# EAGLE design SND_SMD_Replacement (EAGLE 9.6.2)
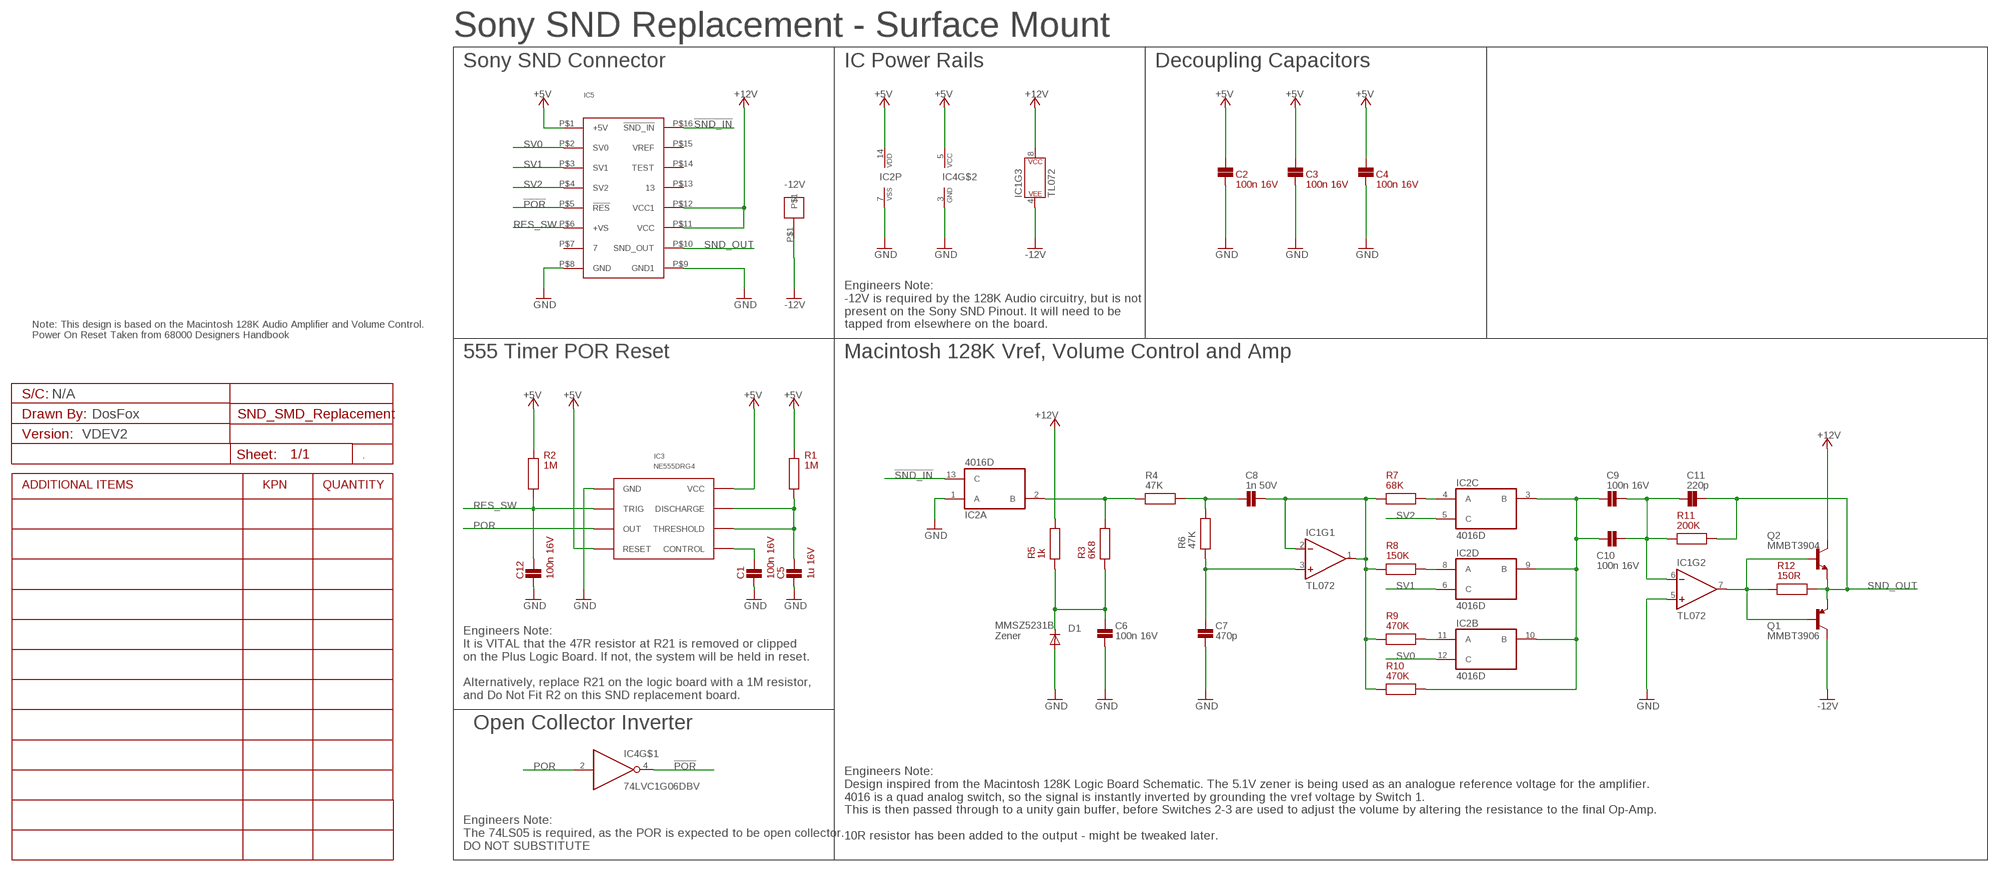
[diagram p0: schematic, sheet 1]

## Parts
-12V  PADS_1W_SMD  [SINGLE_CONN_SMD]
A1  VDEV2  PROJECT_DETAILS_CUSTOM  [PCB_CUSTOM_DETAILS]
C1  100n 16V  100N_CAP_0603  [C0603]
C2  100n 16V  100N_CAP_0603  [C0603]
C3  100n 16V  100N_CAP_0603  [C0603]
C4  100n 16V  100N_CAP_0603  [C0603]
C5  1u 16V  1U_CAP_0603  [C0603]
C6  100n 16V  100N_CAP_0603  [C0603]
C7  470p  100P_CAP_0603  [C0603]
C8  1n 50V  10N_CAP_0603  [C0603]
C9  100n 16V  100N_CAP_0603  [C0603]
C10  100n 16V  100N_CAP_0603  [C0603]
C11  220p  100P_CAP_0603  [C0603]
C12  100n 16V  100N_CAP_0603  [C0603]
D1  5.1V  DIODESOD-123  [SOD-123]
IC1  TL072  OPAMP-DUALU  [SO08]
IC2  4016D  [SO14]
IC3  NE555DRG4  555_SOIC8  [SOIC8]
IC4  74LVC1G06DBV  [SOT23-5]
IC5  SND  [DIP16]
Q1  MMBT3906  TRANS_PNP-PMBT3906|MMBT3906L  [SOT23-3]
Q2  MMBT3904  TRANS_NPN-MMBT2222AL  [SOT23-3]
R1  1M  GENERIC_RESISTOR_0603  [R0603]
R2  1M  GENERIC_RESISTOR_0603  [R0603]
R3  6K8  GENERIC_RESISTOR_0603  [R0603]
R4  47K  47K_RESISTOR  [R0603]
R5  1k  1K_RESISTOR_0603  [R0603]
R6  47K  47K_RESISTOR  [R0603]
R7  68K  GENERIC_RESISTOR_0603  [R0603]
R8  150K  GENERIC_RESISTOR_0603  [R0603]
R9  470K  GENERIC_RESISTOR_0603  [R0603]
R10  470K  GENERIC_RESISTOR_0603  [R0603]
R11  200K  GENERIC_RESISTOR_0603  [R0603]
R12  150R  150R_RESISTOR_0603  [R0603]

## Nets
!POR: IC4.4(O) IC5.P$5(!RES)
!SND_IN: IC2.13(A:C) IC5.P$16(!SND_IN)
+5V: C2.2 C3.2 C4.2 IC2.14(P:VDD) IC3.P$4(RESET) IC3.P$8(VCC) IC4.5(VCC) IC5.P$1(+5V) R1.2 R2.2 ; supply symbol labelled VCC
+12V: IC1.8(P$V+) IC5.P$11(VCC) IC5.P$12(VCC1) Q2.3(C) R5.2 ; supply symbol labelled VCC
-12V: -12V.P$1 IC1.4(P$V-) Q1.3(C) ; supply symbol labelled GND
GND: C1.1 C2.1 C3.1 C4.1 C5.1 C6.1 C7.1 C12.1 D1.A IC1.5(+IN) IC2.1(A:A) IC2.7(P:VSS) IC3.P$1(GND) IC4.3(GND) IC5.P$8(GND) IC5.P$9(GND1)
N$1: IC2.2(A:B) R3.2 R4.1
N$3: C9.1 C10.1 IC2.3(C:B) IC2.9(D:B) IC2.10(B:B) R10.2
N$4: C8.1 R4.2 R6.2
N$5: C6.2 D1.C R3.1 R5.1
N$6: C7.2 IC1.3(+IN) R6.1
N$7: IC2.4(C:A) R7.2
N$8: IC2.8(D:A) R8.2
N$9: IC2.11(B:A) R9.2
N$10: C9.2 C10.2 C11.1 IC1.6(-IN) R11.1
N$11: C5.2 IC3.P$6(THRESHOLD) IC3.P$7(DISCHARGE) R1.1
N$12: C8.2 IC1.1(OUT) IC1.2(-IN) R7.1 R8.1 R9.1 R10.1
N$15: IC1.7(OUT) Q1.1(B) Q2.1(B) R12.1
N$17: C1.2 IC3.P$5(CONTROL)
POR: IC3.P$3(OUT) IC4.2(I)
RES_SW: C12.2 IC3.P$2(TRIG) IC5.P$6(+VS) R2.1
SND_OUT: C11.2 IC5.P$10(SND_OUT) Q1.2(E) Q2.2(E) R11.2 R12.2
SV0: IC2.12(B:C) IC5.P$2(SV0)
SV1: IC2.6(D:C) IC5.P$3(SV1)
SV2: IC2.5(C:C) IC5.P$4(SV2)
Unconnected: IC5.P$7 IC5.P$13 IC5.P$14(TEST) IC5.P$15(VREF)

## Notes on the sheet
- Sony SND Replacement - Surface Mount
- Sony SND Connector | IC Power Rails | Decoupling Capacitors
- Engineers Note:
  -12V is required by the 128K Audio circuitry, but is not 
  present on the Sony SND Pinout. It will need to be 
  tapped from elsewhere on the board.
- Note: This design is based on the Macintosh 128K Audio Amplifier and Volume Control. 
  Power On Reset Taken from 68000 Designers Handbook
- 555 Timer POR Reset | Macintosh 128K Vref, Volume Control and Amp
- N/A
- DosFox
- MMSZ5231B
  Zener
- Engineers Note:
  It is VITAL that the 47R resistor at R21 is removed or clipped
  on the Plus Logic Board. If not, the system will be held in reset. 
  
  Alternatively, replace R21 on the logic board with a 1M resistor,
  and Do Not Fit R2 on this SND replacement board.
- Open Collector Inverter
- Engineers Note:
  Design inspired from the Macintosh 128K Logic Board Schematic. The 5.1V zener is being used as an analogue reference voltage for the amplifier. 
  4016 is a quad analog switch, so the signal is instantly inverted by grounding the vref voltage by Switch 1. 
  This is then passed through to a unity gain buffer, before Switches 2-3 are used to adjust the volume by altering the resistance to the final Op-Amp. 
  
  10R resistor has been added to the output - might be tweaked later.
- Engineers Note:
  The 74LS05 is required, as the POR is expected to be open collector.
  DO NOT SUBSTITUTE

## Library data of the parts
-12V = Connectors:PADS_1W_SMD
A1 = Schematic Symbols:PROJECT_DETAILS; VALUE: VDEV1
C1-C4 C6 C9 C10 C12 = Capacitors SMD:100N_CAP; COMPONENT: Capacitor; COST: =(INDIRECT(ADDRESS(ROW(),1)))*(INDIRECT(ADDRESS(ROW(),13))); EA: =VLOOKUP(INDIRECT(ADDRESS(ROW(),7)),[ProductCosts.xlsx]StockCosts!$A:$B,2,FALSE); KPN: 3106-100N; PACKAGE: 0603; PROCESS: SMD
C5 = Capacitors SMD:1U_CAP; COMPONENT: Capacitor; COST: =(INDIRECT(ADDRESS(ROW(),1)))*(INDIRECT(ADDRESS(ROW(),13))); EA: =VLOOKUP(INDIRECT(ADDRESS(ROW(),7)),[ProductCosts.xlsx]StockCosts!$A:$B,2,FALSE); KPN: 3106-1U; PACKAGE: 0603; PROCESS: SMD
C7 C11 = Capacitors SMD:100P_CAP; COMPONENT: Capacitor; COST: =(INDIRECT(ADDRESS(ROW(),1)))*(INDIRECT(ADDRESS(ROW(),13))); EA: =VLOOKUP(INDIRECT(ADDRESS(ROW(),7)),[ProductCosts.xlsx]StockCosts!$A:$B,2,FALSE); KPN: xxxx; PACKAGE: 0603; PROCESS: SMD; VALUE: 100p
C8 = Capacitors SMD:10N_CAP; COMPONENT: Capacitor; COST: =(INDIRECT(ADDRESS(ROW(),1)))*(INDIRECT(ADDRESS(ROW(),13))); EA: =VLOOKUP(INDIRECT(ADDRESS(ROW(),7)),[ProductCosts.xlsx]StockCosts!$A:$B,2,FALSE); KPN: 3106-10N; PACKAGE: 0603; PROCESS: SMD; VALUE: 10n 50V
D1 = adafruit:DIODE: Diode SMADIODE - SMA Surface Mount Package 20V 1A Schottky Diode Digikey: 641-1014-6-ND DO-1N4148 - Through Hole Small Current Diode SOD-123 20V 1 A (.5mV Vf) Schottky Diode - Digikey: MBRX120TPMSCT-ND SOD-323 10V 570mA (.38mV Vf, 3ns) Schottky Diode - Digikey: ZLLS410CT-ND SOD-523 30V 30mA Schottky Diode (RB751S-40TE61) - Digikey: RB751S-40TE61CT-ND SOT23-R/W - SOT23 Package (R = Solder Paste/Reflow Ovens, W = Hand-Soldering) BAT54Film 40V 300mA - Digikey: 497-7162-1-ND
IC1 = SparkFun-IC-Amplifiers:OPAMP-DUAL: Generic op-amp footprint This component is for the standard 358 pinning of a dual op-amp From the LM358 datasheet: Pin 1: Output A Pin 2: Inverting Input A Pin 3: Non-Inverting Input A Pin 4: Gnd Pin 5: Non-Inverting Input B Pin 6: Inverting Input B Pin 7: Output B Pin 8: V+; PROD_ID: NA-XXXXX; VALUE: OP-AMP
IC2 = 40xx:4016: Quad bilateral ANALOG SWITCH
IC3 = ICs:555; COMPONENT: 555 Timer; COST: =(INDIRECT(ADDRESS(ROW(),1)))*(INDIRECT(ADDRESS(ROW(),13))); EA: =VLOOKUP(INDIRECT(ADDRESS(ROW(),7)),[ProductCosts.xlsx]StockCosts!$A:$B,2,FALSE); KPN: xxxxx; MANUFACTURE: Texas Instruments; PACKAGE: SOIC8; PROCESS: SMD
IC4 = 74xx-little-us:74*1G06: Single Inverter Buffer/Driver With Open-Drain Output
IC5 = ICs:SND; PACKAGE: DIP16; PROCESS: TH
Q1 = SparkFun-DiscreteSemi:TRANS_PNP: PNP transistor Current controlled devices typically used to amplify current or used as a switch. SparkFun Products: SparkFun Serial Enabled 16x2 LCD - Red on Black <https://www.sparkfun.com/products/9068> SparkFun Logomatic <https://www.sparkfun.com/products/12772>; PROD_ID: TRANS-08052; VALUE: 200mA/40V
Q2 = SparkFun-DiscreteSemi:TRANS_NPN: NPN transistor Current controlled devices typically used to amplify current or used as a switch. BC547 - COM-08928 <http://www.sparkfun.com/products/8928> (TO-92 45V 100mA) (1.Collector 2.Base 3.Emitter) 2N3904 - COM-00521 <http://www.sparkfun.com/products/521> (TO-92 40V 200mA) (1.Emitter 2.Base 3.Collector) P2N2222A - COM-12852 <http://www.sparkfun.com/products/12852> (TO-92 40V 600mA) (1.Collector 2.Base 3.Emitter); PROD_ID: TRANS-08049; VALUE: 600mA/40V
R1-R3 R7-R11 = Resistors SMD:GENERIC_RESISTOR; COMPONENT: Resistor; COST: =(INDIRECT(ADDRESS(ROW(),1)))*(INDIRECT(ADDRESS(ROW(),13))); EA: =VLOOKUP(INDIRECT(ADDRESS(ROW(),7)),[ProductCosts.xlsx]StockCosts!$A:$B,2,FALSE); PACKAGE: 0603; PROCESS: SMD
R4 R6 = Resistors SMD:47K_RESISTOR; COMPONENT: Resistor; COST: =(INDIRECT(ADDRESS(ROW(),1)))*(INDIRECT(ADDRESS(ROW(),13))); EA: =VLOOKUP(INDIRECT(ADDRESS(ROW(),7)),[ProductCosts.xlsx]StockCosts!$A:$B,2,FALSE); KPN: 3014-47K; PACKAGE: 0603; PROCESS: SMD
R5 = Resistors SMD:1K_RESISTOR; COMPONENT: Resistor; COST: =(INDIRECT(ADDRESS(ROW(),1)))*(INDIRECT(ADDRESS(ROW(),13))); EA: =VLOOKUP(INDIRECT(ADDRESS(ROW(),7)),[ProductCosts.xlsx]StockCosts!$A:$B,2,FALSE); KPN: 3014-1K; PACKAGE: 0603; PROCESS: SMD
R12 = Resistors SMD:150R_RESISTOR; COMPONENT: Resistor; COST: =(INDIRECT(ADDRESS(ROW(),1)))*(INDIRECT(ADDRESS(ROW(),13))); EA: =VLOOKUP(INDIRECT(ADDRESS(ROW(),7)),[ProductCosts.xlsx]StockCosts!$A:$B,2,FALSE); KPN: 3013-150R; PACKAGE: 0603; PROCESS: SMD

## Board
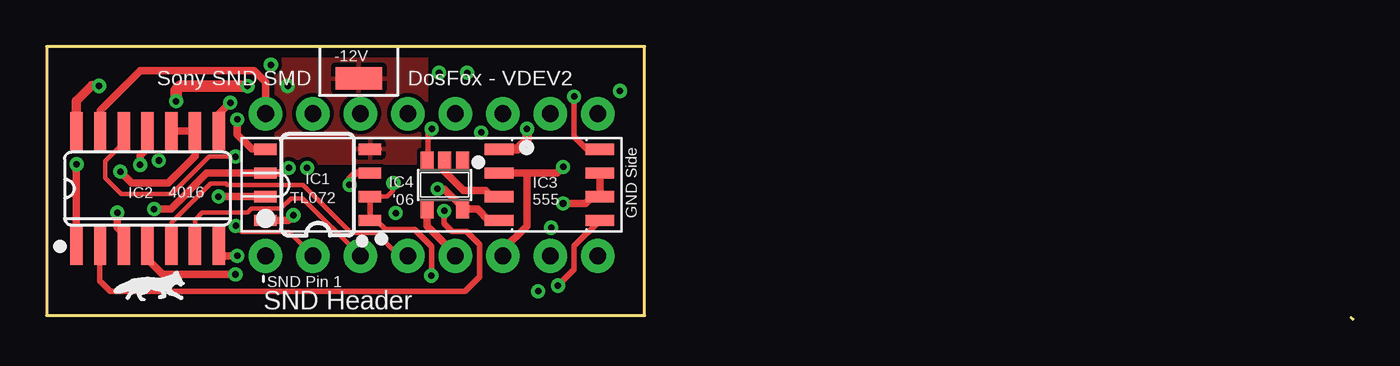
[diagram p1: board, top side]
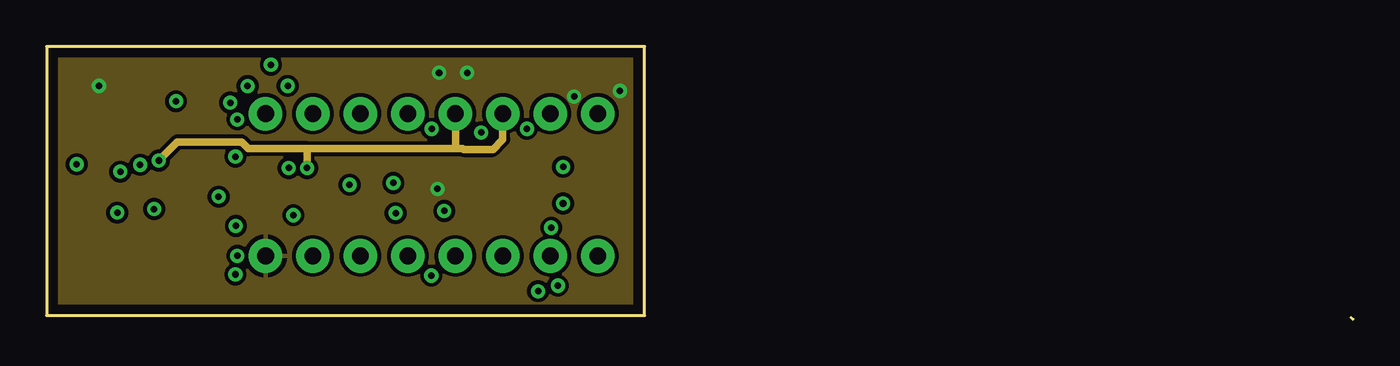
[diagram p2: board, inner layer Route2]
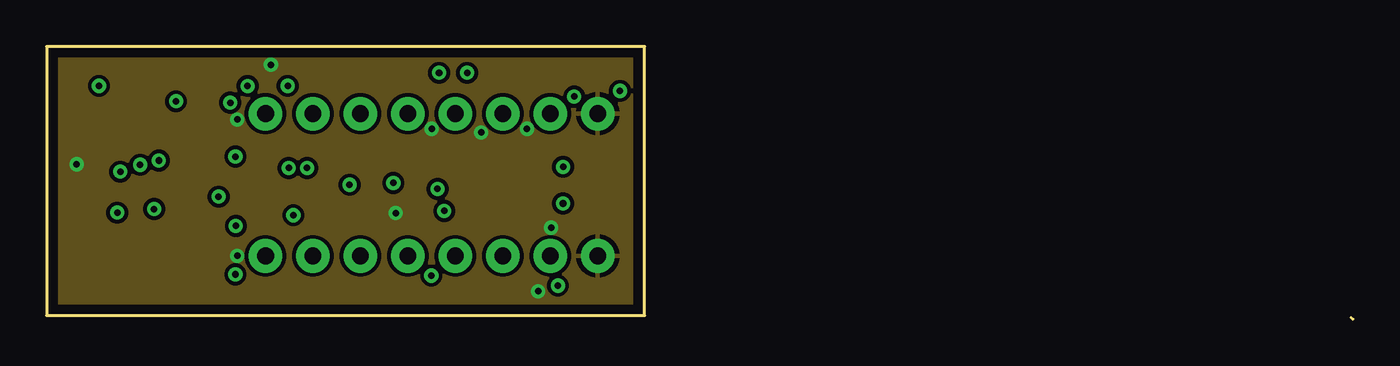
[diagram p3: board, inner layer Route15]
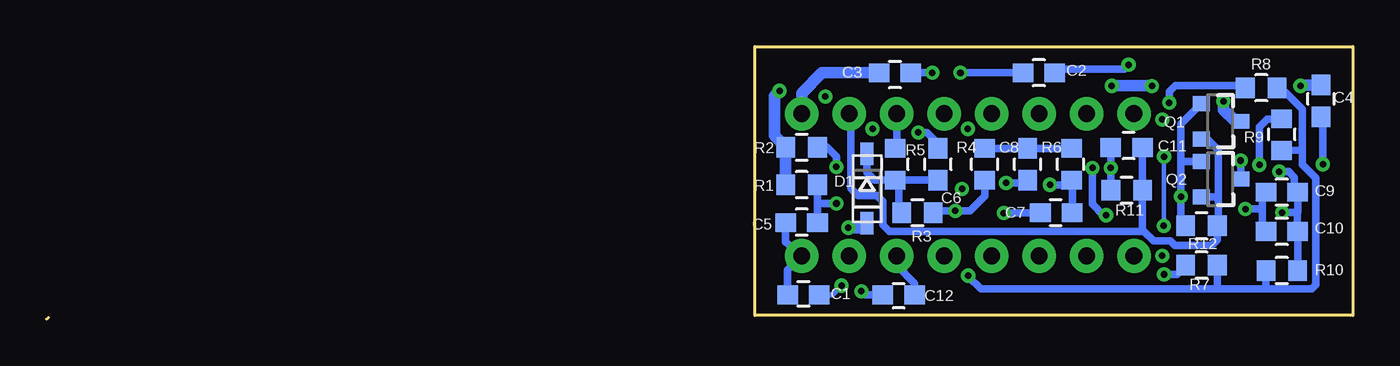
[diagram p4: board, bottom side, seen from below]

Size 69.9 x 14.6 mm. Coordinates in mm from the lower left corner, seen from the top.
Outline: 69.8,0.1 69.9,0
Outline: 0,0.2 32,0.2 32,14.6 0,14.6 0,0.2
Copper layers (1+2*15+16): Top 0.035mm / dielectric 1.5mm / Route2 0.035mm / dielectric 0.15mm / Route15 0.035mm / dielectric 0.2mm / Bottom 0.035mm
Design rules "default *": minimum track width 0.2mm, minimum drill 0.25mm, track to track 8mil, track to pad 8mil, pad to pad 8mil, via to via 8mil, smd to smd 8mil, copper to edge 20mil, drill to drill 8mil, minimum pad ring 1mil, minimum via ring 8mil, stop-mask expansion 4mil, vias tented up to drill 1mm, thermal gap 10mil

### Footprints (pad centres in the part's own frame; a part is rotated, then mirrored left to right if it is on the bottom)
SINGLE_CONN_SMD = smd 2.5 x 1.2: P$1 0,0
C0603 = smd 1.1 x 1: 1 -0.85,0; 2 0.85,0
SOD-123 = smd 1.2 x 0.7: A 1.85,0; C -1.85,0
SO08 = smd 0.6 x 1.2: 1 -1.905,-2.8; 2 -0.635,-2.8; 3 0.635,-2.8; 4 1.905,-2.8; 5 1.905,2.8; 6 0.635,2.8; 7 -0.635,2.8; 8 -1.905,2.8
SO14 = smd 0.66 x 2.032: 1 -3.81,-3.073; 2 -2.54,-3.073; 3 -1.27,-3.073; 4 0,-3.073; 5 1.27,-3.073; 6 2.54,-3.073; 7 3.81,-3.073; 8 3.81,3.073; 9 2.54,3.073; 10 1.27,3.073; 11 0,3.073; 12 -1.27,3.073; 13 -2.54,3.073; 14 -3.81,3.073
SOIC8 = smd 1.55 x 0.6: P$1 -2.7,1.905; P$2 -2.7,0.635; P$3 -2.7,-0.635; P$4 -2.7,-1.905; P$5 2.7,-1.905; P$6 2.7,-0.635; P$7 2.7,0.635; P$8 2.7,1.905
SOT23-5 = smd 0.69 x 0.99: 1 -0.95,-1.29; 2 0,-1.29; 3 0.95,-1.29; 4 0.95,1.3; 5 -0.95,1.3
DIP16 = drill 0.9 pad 1.8: P$1 -8.89,-3.81; P$2 -6.35,-3.81; P$3 -3.81,-3.81; P$4 -1.27,-3.81; P$5 1.27,-3.81; P$6 3.81,-3.81; P$7 6.35,-3.81; P$8 8.89,-3.81; P$9 8.89,3.81; P$10 6.35,3.81; P$11 3.81,3.81; P$12 1.27,3.81; P$13 -1.27,3.81; P$14 -3.81,3.81; P$15 -6.35,3.81; P$16 -8.89,3.81
SOT23-3 = smd 0.8 x 0.9: 1 -0.95,-1; 2 0.95,-1; 3 0,1.1
R0603 = smd 1 x 1.1: 1 -0.85,0; 2 0.85,0

### Placement (x,y rotation side)
-12V  16.7,12.9 0 top
A1  -120.65,1.47 0 top  (outside the outline)
C1  29.4,1.3 0 bottom
C2  16.8,13.2 180 bottom
C3  24.5,13.2 0 bottom
C4  1.7,11.7 90 bottom
C5  29.5,5.17 0 bottom
C6  22.2,8.3 270 bottom
C7  15.87,5.7 0 bottom
C8  17.4,8.3 270 bottom
C9  3.8,6.8 180 bottom
C10  3.8,4.7 180 bottom
C11  12.1,9.2 0 bottom
C12  24.3,1.3 0 bottom
D1  26,7 270 bottom
IC1  14.5,7.2 90 top
IC2  5.4,7 0 top
IC3  26.9,7.2 0 top
IC4  21.3,7.2 180 top
IC5  20.6,7.2 0 top
Q1  7.1,10.6 270 bottom
Q2  7.1,7.5 270 bottom
R1  29.5,7.2 180 bottom
R2  29.5,9.22 180 bottom
R3  23.3,5.7 0 bottom
R4  19.7,8.3 90 bottom
R5  24.5,8.3 90 bottom
R6  15.05,8.3 90 bottom
R7  8.1,2.9 180 bottom
R8  4.9,12.4 180 bottom
R9  3.81,9.88 90 bottom
R10  3.8,2.6 0 bottom
R11  12.1,6.9 0 bottom
R12  8.1,5 0 bottom

### Tracks (layer width: path | path; a pad name or v marks a point on that pad's centre or on a via)
!POR
  Top 0.406: IC5.P$5 21.87,3.48 20.35,5 IC4.4
!SND_IN
  Top 0.406: IC5.P$16 11.71,12.71 11.12,13.3 5,13.3 2.86,11.16 IC2.13
+5V  (via drill 0.35)
  Top 0.305: v28.23,11.93 28.23,9.77 28.9,9.1 IC3.P$8
  Top 0.406: IC3.P$4 23.66,5.29 23.05,5.9 IC4.5 22.25,6 21.27,6.98 v20.91,6.98
  Top 0.508: IC2.14 1.59,11.69 2.4,12.5 v2.8,12.5
  Bottom 0.406: 22.49,13.21 v22.5,13.2 C3.2 | R1.2 30.26,7.11 | v21,13.2 C2.2
  Bottom 0.61: R1.2 R2.2 30.95,9.82 30.95,11.95 v30.68,12.23 | C4.2 2.75,12.55 v2.8,12.5
  pour Route2: 32,14.6 32,0.2 0,0.2 0,14.6
+12V  (via drill 0.35)
  Top 0.406: IC1.8 12.93,5.29 v13.2,5.57
  Route2 0.406: IC5.P$12 21.87,9.13 | 13.94,9.13 21.87,9.13 | 21.87,9.13 22.27,9.13 22.3,9.1 23.89,9.1 24.41,9.62 IC5.P$11 | v6,8.5 6.35,8.85 6.69,9.19 6.99,9.49 10.43,9.49 10.79,9.13 13.94,9.13 | v13.94,8.1 13.94,9.13
  Bottom 0.406: v6,8.5 Q2.3 | IC5.P$11 24.41,9.24 R5.2 | v13.2,5.57 13.35,5.57 13.94,6.16 v13.94,8.09 v13.94,8.1
-12V  (via drill 0.35)
  Top 0.406: 17.75,9.1 IC1.4
  Top 0.61: v6.92,11.68 6.92,12.28 7.14,12.49 v10.75,12.49
  Bottom 0.406: Q1.3 6.3,10.6 | v10.75,12.49 v10.76,12.5
  Bottom 0.61: v6.92,11.68 6.92,11.22 6.3,10.6 | v12.9,12.5 v10.76,12.5
  pour Top: 12.3,14.6 12.3,8.4 20.3,8.4 20.3,14.6
GND  (via drill 0.35)
  Top 0.305: v20.6,10.2 20.5,10.2 20.4,10.1 20.4,8.54 IC4.3
  Top 0.406: v10.2,3.4 9.21,3.4 IC2.7 | IC1.5 10.99,9.1 10.2,9.9 v10.2,10.7 | v1.6,8.3 v1.59,8.29 IC2.1
  Top 0.508: IC3.P$1 25.2,9.1 25.7,9.6 v25.7,10.2
  Bottom 0.406: v18.68,5.68 16.7,5.68 C7.1 | v23.25,10 22.8,10 22.2,9.4 C6.1 | C4.1 1.6,10.75 v1.6,8.3 | C5.1 30.35,4.14 IC5.P$8 30.25,2.63 C1.1 | C2.1 15.85,13.2 15.65,13.4 12.23,13.4 v12,13.63 | v26.3,1.5 26.1,1.3 C12.1
  Bottom 0.61: C3.1 28.4,13.2 29.49,12.11 IC5.P$9 | D1.A 26,4.9 v27,4.9
  pour Route15: 0,14.6 0.1,0.1 32,0.2 32,14.6
N$1  (via drill 0.35)
  Top 0.305: IC2.2 2.84,3.91 2.84,2.06 3.41,1.5 22.4,1.5 23.15,2.25 23.15,4.01 22.46,4.7 21.7,4.7 21.28,5.12 v21.28,5.8
  Bottom 0.406: R4.1 19.7,6.6 20.5,5.8 v21.28,5.8 22.35,5.8 R3.2
N$3  (via drill 0.35)
  Top 0.406: IC2.10 IC2.9 7.94,8.73 6.5,7.29 4.55,7.29 v3.94,7.9 | IC2.3 4.13,4.54 3.78,4.91 v3.78,5.71
  Bottom 0.406: v3.94,7.9 3.44,7.9 3.14,7.6 3.14,6.99 C9.1 2.95,5.72 2.97,5.72 | R10.2 C10.1 2.97,5.72 | v3.78,5.71 2.98,5.71 2.97,5.72
N$4
  Bottom 0.406: R6.2 C8.1 R4.2
N$5
  Bottom 0.406: D1.C 26,7.85 25.6,7.45 R5.1 | R5.1 C6.2 | R5.1 24.3,7.25 24.3,5.85 R3.1
N$6  (via drill 0.35)
  Top 0.406: v16.21,7.2 16.21,7.5 16.55,7.83 IC1.3
  Bottom 0.406: C7.2 15.02,7.42 R6.1 15.3,7.2 v16.21,7.2
N$7  (via drill 0.35)
  Top 0.406: IC2.4 5.4,3.2 6.2,2.4 v10.1,2.4
  Bottom 0.406: R7.2 8.95,2.85 9.4,2.4 v10.1,2.4
N$8  (via drill 0.35)
  Top 0.406: IC2.8 9.21,10.99 v9.82,11.6
  Bottom 0.406: R8.2 5.85,12.5 9.5,12.5 9.82,12.18 v9.82,11.6
N$9  (via drill 0.35)
  Top 0.406: IC2.11 5.4,9.17 5,8.77 v5,8.28
  Bottom 0.406: v5,8.28 5,10.3 4.57,10.73 R9.2
N$10  (via drill 0.35)
  Top 0.406: v5.75,5.9 6.65,5.9 8.57,7.82 11.69,7.82 IC1.6 12.69,7.83 v12.95,8.1
  Bottom 0.406: R11.1 v12.95,8.1 C11.1 | C9.2 4.85,6.6 4.85,5.9 | 4.85,5.9 4.85,4.9 C10.2 | 4.85,5.9 v5.75,5.9
N$11  (via drill 0.35)
  Top 0.406: IC3.P$7 IC3.P$6 29.2,6.57 28.84,6.2 v27.64,6.2
  Bottom 0.406: R1.1 28.65,6.2 | 28.65,6.2 C5.2 | v27.64,6.2 28.65,6.2
N$12  (via drill 0.35)
  Top 0.254: v18.55,7.3 18.55,6.9 18.21,6.57 IC1.2
  Top 0.305: v20.59,2.33 20.59,3.91 19.7,4.8 18.14,4.8 17.64,5.29 IC1.1 IC1.2
  Bottom 0.406: R9.1 2.78,9.05 2.71,8.99 | 4.72,1.61 2.19,1.61 1.99,1.83 1.99,7.57 2.71,8.29 2.71,8.99 | 4.72,1.61 7.21,1.61 | R7.1 7.25,1.65 7.21,1.61 | 4.72,1.61 4.65,1.69 R10.1 | 7.21,1.61 19.91,1.61 20.59,2.29 v20.59,2.33 | R8.1 3.85,12.4 2.71,11.26 2.71,8.99 | v18.55,7.3 17.55,7.3 C8.2
N$15  (via drill 0.35)
  Top 0.406: IC1.7 v9.2,6.57
  Bottom 0.406: v9.2,6.57 9.2,8.45 Q2.1 | Q1.1 9.2,10.45 v9.2,6.57 | v9.2,6.57 9.2,5.5 R12.1
N$17  (via drill 0.35)
  Top 0.305: IC3.P$5 28.23,3.93 28.23,2.68 v27.36,1.8
  Bottom 0.305: C1.2 27.86,1.3 v27.36,1.8
POR
  Top 0.406: IC4.2 21.3,7.9 22.3,6.9 23.5,6.9 23.8,6.6 24.16,6.6 IC3.P$3
RES_SW  (via drill 0.35)
  Top 0.406: 25.7,7.83 IC3.P$2 | 25.7,7.83 25.7,5 24.41,3.71 IC5.P$6 | v27.64,8.16 27.31,7.83 25.7,7.83
  Bottom 0.406: C12.2 23.45,1.93 24.41,2.89 IC5.P$6 | R2.1 28.15,9.22 27.64,8.71 v27.64,8.16
SND_OUT
  Bottom 0.406: Q1.2 7.78,9.65 7.2,9.07 7.2,6.55 | 7.2,6.55 Q2.2 | 7.2,6.55 7.2,5.05 R12.2 7.25,4.25 7.56,3.94 9.53,3.94 9.78,4.18 10.66,4.18 11.18,4.7 | C11.2 R11.2 11.25,4.78 11.18,4.7 | IC5.P$10 26.85,10.91 26.85,7 26.48,6.63 25.48,6.63 25.16,6.3 25.16,5.06 24.8,4.7 11.18,4.7
SV0  (via drill 0.35)
  Top 0.254: IC2.12 4.13,9.47 3.13,8.47 3.13,7.57 3.99,6.71 6.7,6.71 8.7,8.71 v10.1,8.71 | IC5.P$2 12.97,4.67 10.44,4.67 10.12,4.98 v10.12,5
  Bottom 0.254: v10.1,8.71 10.1,5.02 v10.12,5
SV1
  Top 0.254: IC2.6 7.94,5.33 8.32,5.71 10.75,5.71 10.96,5.92 12.52,5.92 13.07,6.48 13.7,6.48 IC5.P$3
SV2
  Top 0.254: IC5.P$4 19.03,3.39 18.88,3.37 17.63,4.62 16.3,4.62 13.73,7.2 9.67,7.2 9.59,7.27 8.78,7.27 6.7,5.19 6.7,3.96 IC2.5

### Text on the board
tNames: -12V | Sony SND SMD DosFox - VDEV2 | 4016 | TL072 | '06 | IC3 / 555 | GND Side | SND Pin 1 | SND Header
tDocu: RP2040 Development Board | Yes | Yes | 32 x 14.4mm | Yes | 2 | Yes | Yes | Yes | No | HASL (Lead Free) | Yes | Green (Both Sides) | Yes | White (Both Sides) | Yes | Yes | Yes | No | No | No